# Altium project Uzcar.PrjPCB
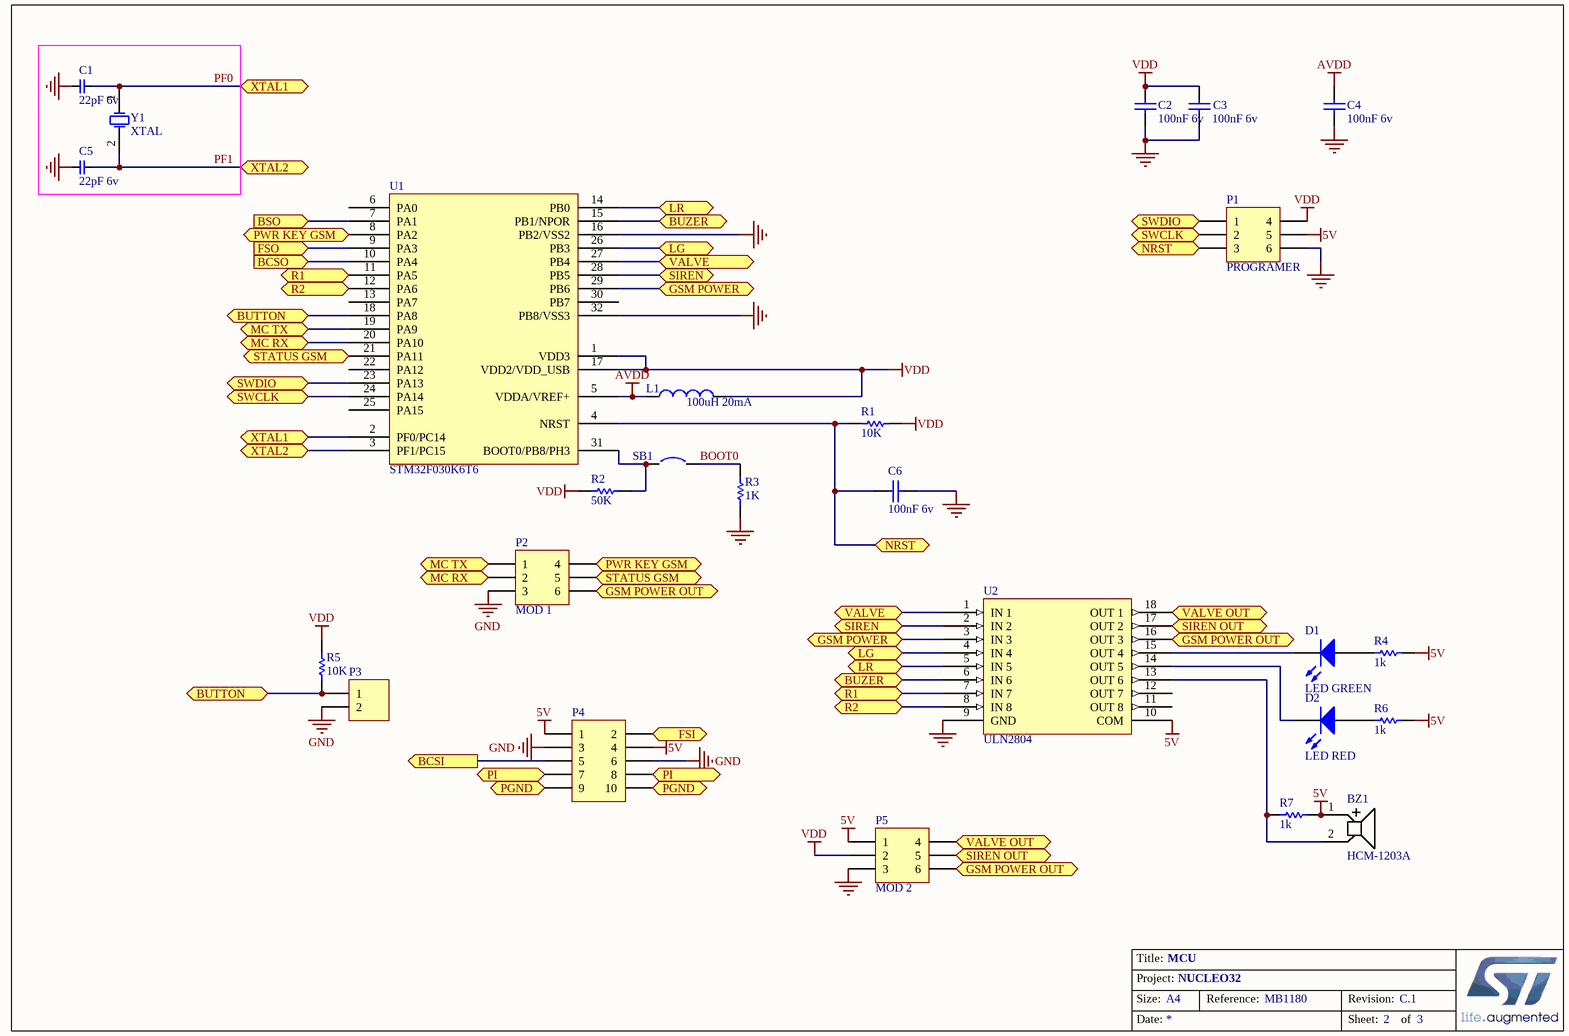
[diagram p0: Copy of MCU_32.SchDoc]
2 sheets, 70 parts. Net scope: global (net labels, ports and power ports of the same name join across sheets).
Board file: Uzcar.PcbDoc
Sheets:
  Copy of MCU_32.SchDoc
  MCU_32_1.SchDoc

## Sheet Copy of MCU_32.SchDoc: MCU
size A4; DocumentNumber: MB1180; Revision: C.1; SheetNumber: 2; SheetTotal: 3; Project: NUCLEO32

### Parts
BZ1  HCM-1203A  [HCM-1203A]
C1  22pF 6v  [CAP0603]
C2  100nF 6v  [0603C]
C3  100nF 6v  [0603C]
C4  100nF 6v  [0603C]
C5  22pF 6v  [CAP0603]
C6  100nF 6v  [0603C]
D1  LED GREEN  [My Green Led]
D2  LED RED  [My_LED3MM]
L1  100uH 20mA  [0603L]
P1  PROGRAMER  [HDR2X3_CEN]
P2  MOD 1  [HDR2X3_CEN]
P3  MHDR1X2  [HDR1X2]  (value not drawn)
P4  Header 5X2  [HDR2X5]  (value not drawn)
P5  MOD 2  [HDR2X3_CEN]
R1  10K  [0603R]
R2  50K  [0603R]
R3  1K  [0603R]
R4  1k  [RES 1206/3216]
R5  10K  [0603R]
R6  1k  [RES 1206/3216]
R7  1k  [RES 1206/3216]
SB1  Circuit Breaker  [SB_0603]  (value not drawn)
U1  STM32F030K6T6  [LQFP32_0R5_7x7]
U2  ULN2804  [SOL-18_N]
Y1  XTAL  [3SMXA]

### Ports
BCSI (out), BCSO (in), BSO (in), BUTTON, BUZER (bidir), FSI (out), FSO (in), GSM POWER (bidir), GSM POWER OUT (out), LG (bidir), LR (bidir), MC RX (bidir), MC TX (bidir), NRST, PGND (bidir), PI (bidir), PWR KEY GSM (bidir), R1 (bidir), R2 (bidir), SIREN (bidir), SIREN OUT (out), STATUS GSM (bidir), SWCLK, SWDIO, VALVE (bidir), VALVE OUT (out), XTAL1 (bidir), XTAL2 (bidir)

### Nets
5V: BZ1.1 P1.5 P4.1 P4.4 P5.1 R4.2 R6.2 R7.1 U2.10(COM)
AVDD: C4.1 L1.1 U1.5(VDDA/VREF+)
GND: C1.2 C2.2 C3.2 C4.2 C5.2 C6.1 P1.6 P2.3 P3.2 P4.3 P4.6 P5.3 R3.2 U1.16(PB2/VSS2) U1.32(PB8/VSS3) U2.9(GND)
VDD: C2.1 C3.1 L1.2 P1.4 P5.2 R1.1 R2.2 R5.1 U1.1(VDD3) U1.17(VDD2/VDD_USB)
BOOT0: R3.1 SB1.2
PF0: C1.1 U1.2(PF0/PC14) Y1.1(OSC1) ; port XTAL1
PF1: C5.1 U1.3(PF1/PC15) Y1.2(OSC2) ; port XTAL2
NetBZ1_2: BZ1.2 R7.2 U2.13(OUT_6)
NetC6_2: C6.2 P1.3 R1.2 U1.4(NRST) ; port NRST
NetC20_2: P4.9 P4.10 ; port PGND
NetD1_A: D1.A R4.1
NetD1_K: D1.K U2.15(OUT_4)
NetD2_A: D2.A R6.1
NetD2_K: D2.K U2.14(OUT_5)
NetP1_1: P1.1 U1.23(PA13) ; port SWDIO
NetP1_2: P1.2 U1.24(PA14) ; port SWCLK
NetP2_1: P2.1 U1.19(PA9) ; port MC TX
NetP2_2: P2.2 U1.20(PA10) ; port MC RX
NetP2_4: P2.4 U1.8(PA2) ; port PWR KEY GSM
NetP2_5: P2.5 U1.21(PA11) ; port STATUS GSM
NetP2_6: P2.6 P5.6 U2.16(OUT_3) ; port GSM POWER OUT
NetP3_1: P3.1 R5.2 U1.18(PA8) ; port BUTTON
NetP4_2: P4.2 ; port FSI
NetP4_5: P4.5 ; port BCSI
NetP4_7: P4.7 P4.8 ; port PI
NetP5_4: P5.4 U2.18(OUT_1) ; port VALVE OUT
NetP5_5: P5.5 U2.17(OUT_2) ; port SIREN OUT
NetR2_1: R2.1 SB1.1 U1.31(BOOT0/PB8/PH3)
NetU1_7: U1.7(PA1) ; port BSO
NetU1_9: U1.9(PA3) ; port FSO
NetU1_10: U1.10(PA4) ; port BCSO
NetU1_11: U1.11(PA5) U2.7(IN_7) ; port R1
NetU1_12: U1.12(PA6) U2.8(IN_8) ; port R2
NetU1_14: U1.14(PB0) U2.5(IN_5) ; port LR
NetU1_15: U1.15(PB1/NPOR) U2.6(IN_6) ; port BUZER
NetU1_26: U1.26(PB3) U2.4(IN_4) ; port LG
NetU1_27: U1.27(PB4) U2.1(IN_1) ; port VALVE
NetU1_28: U1.28(PB5) U2.2(IN_2) ; port SIREN
NetU1_29: U1.29(PB6) U2.3(IN_3) ; port GSM POWER

Not connected (* = marked no-connect by the designer): U1 6(PA0) 13(PA7) 22(PA12) 25(PA15) 30(PB7); U2 11(OUT_8) 12(OUT_7)

### Notes on the sheet
- Title:
- Project:
- Size:
- Date:
- A4
- Reference:
- Sheet:
- Revision:
- of

### Library data of the parts
BZ1 = HCM-1203A: HCM-1203A buzzer
C1 C5 = Capacitor_np: Value: 22pF 5v
C2 = Cap: Capacitor 100nF 5v; Value: 10nF; Published: 8-Jun-2000; Revision: July-2002: Re-released for DXP Platform.; Publisher: Altium Limited
C3 C4 = Cap: Capacitor; Value: 10nF; Published: 8-Jun-2000; Revision: July-2002: Re-released for DXP Platform.; Publisher: Altium Limited
C6 = CAP: Capacitor; Value: 100pF; Published: 8-Jun-2000; Revision: July-2002: Re-released for DXP Platform.; Publisher: Altium Limited
D1 D2 = LED3m: Typical INFRARED GaAs LED; Published: 8-Jun-2000; LatestRevisionDate: 08-Jul-2005; LatestRevisionNote: Mech Layer 1 removed.; Publisher: Altium Limited
L1 = Inductor: Published: 8-Jun-2000; Revision: July-2002: Re-released for DXP Platform.; Publisher: Altium Limited; Value: 100uH
P1 P2 P5 = Header 3X2A: Header, 3-Pin, Dual row; LatestRevisionDate: 17-Jul-2002; LatestRevisionNote: Re-released for DXP Platform.; Publisher: Altium Limited
P3 = MHDR1X2: Header, 2-Pin; LatestRevisionDate: 17-Jul-2002; LatestRevisionNote: Re-released for DXP Platform.; Publisher: Altium Limited
P4 = Header 5X2: Header, 5-Pin, Dual row; LatestRevisionDate: 17-Jul-2002; LatestRevisionNote: Re-released for DXP Platform.; Publisher: Altium Limited
R1 R2 R5 = Res1: Resistor; Value: 1K; Published: 8-Jun-2000; Revision: July-2002: Re-released for DXP Platform.; Publisher: Altium Limited
R3 = res1: Resistor; Published: 8-Jun-2000; Revision: July-2002: Re-released for DXP Platform.; Publisher: Altium Limited; Value: 1K
R4 R6 R7 = Resistor1: Resistor; Value: =Value
SB1 = Circuit Breaker: Solder: NO; Published: 24-Mar-1999; Revision: July-2002: Re-released for DXP Platform.; Publisher: Altium Limited
U1 = MCU_LQFP32: Type: STM32F030K6T6
U2 = ULN2803: HIGH-VOLTAGE,HIGH-CURRENT DARLINTON ARRAYS
Y1 = XTAL: Crystal Oscillator 0.197" L x 0.126" W (5.00mm x 3.20mm); Published: 8-Jun-2000; LatestRevisionDate: 17-Jul-2002; LatestRevisionNote: Re-released for DXP Platform.; PackageReference: R38; Publisher: Altium Limited; PackageDescription: Crystal, Thru-Hole; 2 Leads; Body 3.1 x 8.2 mm (Dia.xH)

## Sheet MCU_32_1.SchDoc
size A4
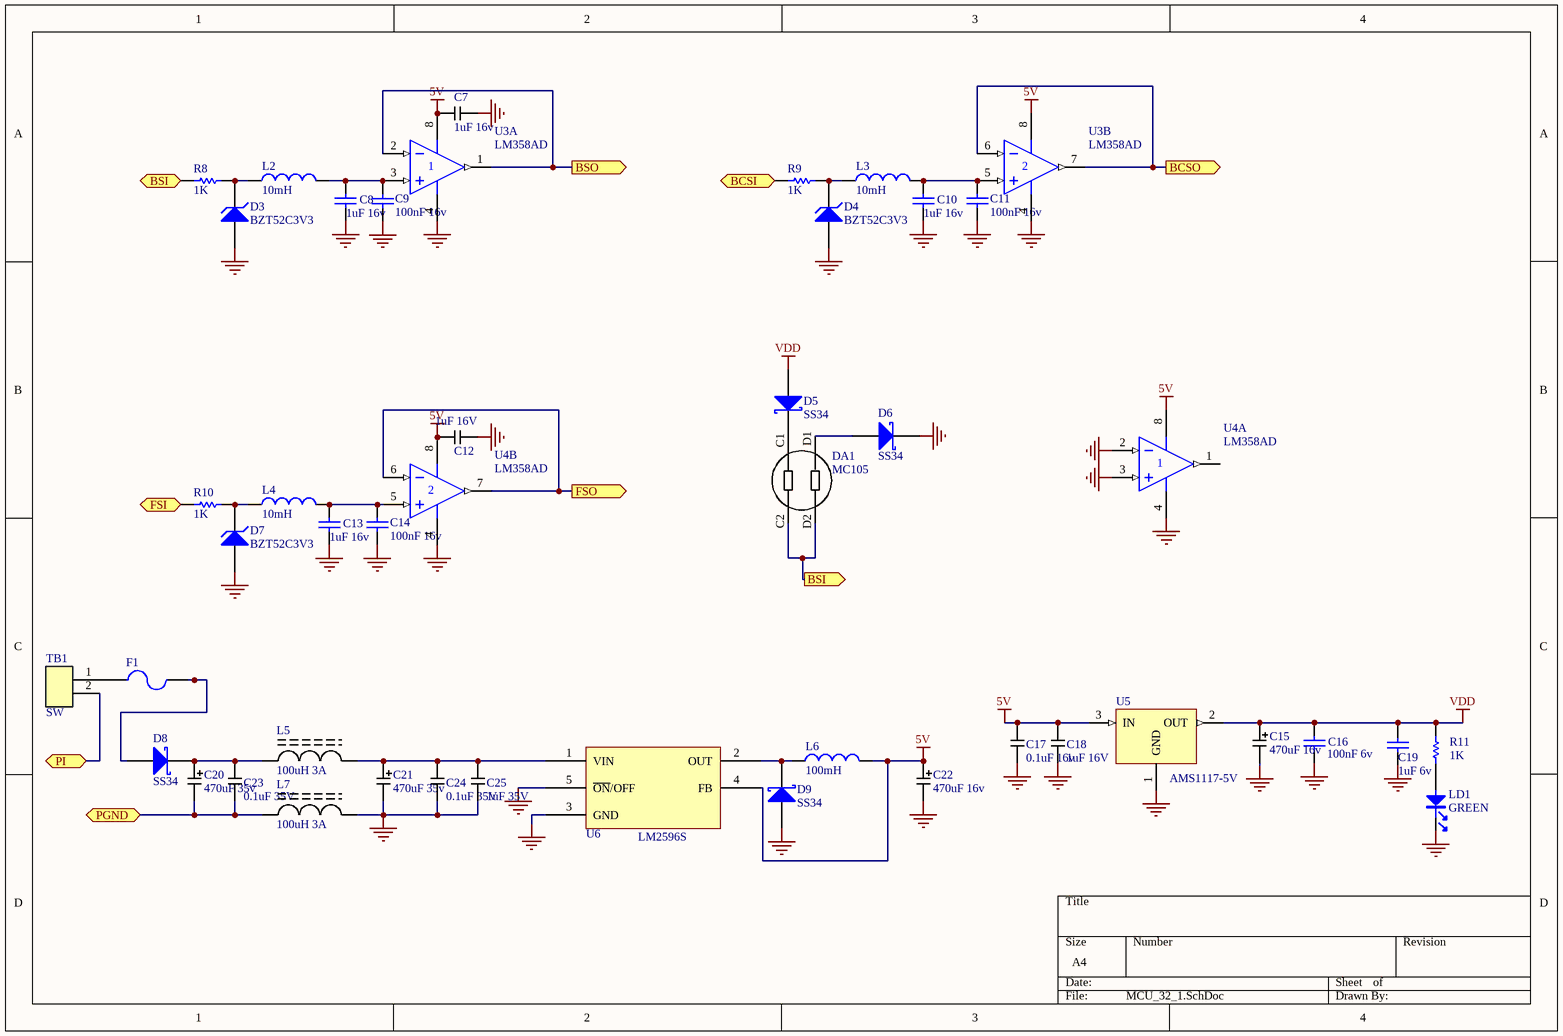
[diagram p1: MCU_32_1.SchDoc]

### Parts
C7  1uF 16v  [C1206]
C8  1uF 16v  [0603C]
C9  100nF 16v  [0603C]
C10  1uF 16v  [0603C]
C11  100nF 16v  [0603C]
C12  1uF 16V  [C1206]
C13  1uF 16v  [0603C]
C14  100nF 16v  [0603C]
C15  470uF 16v  [C_EL_8]
C16  100nF 6v  [0603C]
C17  0.1uF 16v  [C1206]
C18  1uF 16V  [C1206]
C19  1uF 6v  [0603C]
C20  470uF 35v  [C_EL_10]
C21  470uF 35v  [C_EL_10]
C22  470uF 16v  [C_EL_8]
C23  0.1uF 35V  [C1206]
C24  0.1uF 35V  [C1206]
C25  1uF 35V  [C1206]
D3  BZT52C3V3  [SOD-123]
D4  BZT52C3V3  [SOD-123]
D5  SS34  [SMB]
D6  SS34  [SMB]
D7  BZT52C3V3  [SOD-123]
D8  SS34  [SMB]
D9  SS34  [SMB]
DA1  MC105  [MC105]
F1  Fuse 2  [1812]  (value not drawn)
L2  10mH  [6-0805_L]
L3  10mH  [6-0805_L]
L4  10mH  [6-0805_L]
L5  100uH 3A  [NR60]
L6  100mH  [IND12500]
L7  100uH 3A  [NR60]
LD1  GREEN  [0603D_R]
R8  1K  [0603R]
R9  1K  [0603R]
R10  1K  [0603R]
R11  1K  [0603R]
TB1  SW  [terminal block2p]
U3  LM358AD  [SO-8]  (parts A,B of 2)
U4  LM358AD  [SO-8]  (parts A,B of 2)
U5  AMS1117-5V  [AMS1117]
U6  LM2596S  [TO-263]

### Ports
BCSI (in), BCSO (out), BSI (in), BSI (out), BSO (out), FSI (in), FSO (out), PGND (bidir), PI (bidir)

### Nets
5V: C7.1 C12.1 C17.1 C18.1 C22.1 L6.2 U3.8(V+) U4.8(V+) U5.3(IN) U6.4(FB)
GND: C7.2 C8.2 C9.2 C10.2 C11.2 C12.2 C13.2 C14.2 C15.2 C16.1 C17.2 C18.2 C19.2 C21.2 C22.2 C24.2 C25.2 D3.1(A) D4.1(A) D6.2(K) D7.1(A) D9.1(A) L7.2 LD1.2 U3.4(V-) U4.2(IN-) U4.3(IN+) U4.4(V-) U5.1(GND) U6.3(GND) U6.5(~{ON}/OFF)
VDD: C15.1 C16.2 C19.1 D5.1(A) R11.2 U5.2(OUT)
NetC8_1: C8.1 C9.1 L2.2 U3.3(IN+)
NetC10_1: C10.1 C11.1 L3.2 U3.5(IN+)
NetC13_1: C13.1 C14.1 L4.2 U4.5(IN+)
NetC20_1: C20.1 C23.1 D8.2(K) L5.1
NetC20_2: C20.2 C23.2 L7.1 ; port PGND
NetC21_1: C21.1 C24.1 C25.1 L5.2 U6.1(VIN)
NetD3_2: D3.2(K) L2.1 R8.1
NetD4_2: D4.2(K) L3.1 R9.1
NetD5_2: D5.2(K) DA1.C1
NetD6_1: D6.1(A) DA1.D1
NetD7_2: D7.2(K) L4.1 R10.1
NetD8_1: D8.1(A) F1.2
NetD9_2: D9.2(K) L6.1 U6.2(OUT)
NetDA1_C2: DA1.C2 DA1.D2 R8.2 ; port BSI
NetF1_1: F1.1 TB1.1
NetLD1_1: LD1.1 R11.1
NetP4_2: R10.2 ; port FSI
NetP4_5: R9.2 ; port BCSI
NetP4_7: TB1.2 ; port PI
NetU1_7: U3.1(OUT) U3.2(IN-) ; port BSO
NetU1_9: U4.6(IN-) U4.7(OUT) ; port FSO
NetU1_10: U3.6(IN-) U3.7(OUT) ; port BCSO

Not connected (* = marked no-connect by the designer): U4 1(OUT)

### Library data of the parts
C7 = C: Capacitor 1uF 16v
C8 C10 C13 C19 = CAP SMD 0603  X5R 1µF 25V 10%: 0603  X5R 1µF; Rated voltage: 25V; Tolerance: 10%; Manufacturer: *; Manufacturer P/N: *; Order code Farnell: 1288202RL; Value: 1µF; Power: *; Technology: X5R; Temperature  Factor: *; Temperature Max: +125°C; Temperature Min: -55°C; STS Code: *
C9 C11 C14 = CAP: Capacitor; Value: 100pF; Published: 8-Jun-2000; Revision: July-2002: Re-released for DXP Platform.; Publisher: Altium Limited
C12 C18 = C: Capacitor 1uF 16V
C15 C20-C22 = CP: Capacitor polarized
C16 = Capacitor_ST: Capacitor 0402 / 0603 / 0805; Revision: July-2002: Re-released for DXP Platform.; Value: 100nF
C17 = C: Capacitor 0.1uF 12V
C23 = C: Capacitor 0.1uF 35V
C24 = C: Capacitor 0.1uF 25V
C25 = C: Capacitor 1uF 25V
D3 D4 D7 = BZT52C3V6: Surface Mount Zener Diode; Published: 8-Jun-2000; LatestRevisionDate: 17-Jul-2002; LatestRevisionNote: Re-released for DXP Platform.; DatasheetDocument: REV. L-2; PackageReference: SOD-123; Publisher: Altium Limited; ComponentLink1Description: Manufacturer Link; ComponentLink1URL: http://www.vishay.com/
D5 D6 D8 D9 = D Schottky: Schottky Diode 40V 3A; Published: 8-Jun-2000; LatestRevisionDate: 17-Jul-2002; LatestRevisionNote: Re-released for DXP Platform.; PackageReference: SMB; Publisher: Altium Limited; PackageDescription: DO-214-AA/SMB; 2 C-Bend Leads; Body 5.3 x 3.6 mm, inc. leads (LxW); Code_JEDEC: DO-214-AA
F1 = Fuse 2: Fuse; Published: 8-Jun-2000; LatestRevisionDate: 17-Jul-2002; LatestRevisionNote: Re-released for DXP Platform.; PackageReference: PIN-W2/E2.8; Publisher: Altium Limited; PackageDescription: Thru-Hole; 2 Leads
L2-L4 L6 = Inductor: Code_IEC: 1005; Published: 8-Jun-2000; LatestRevisionDate: 29-May-2009; LatestRevisionNote: IPC-7351 Footprint Added.; PackageReference: 0402-A; Publisher: Altium Limited; PackageDescription: Chip Inductor; Code_JEITA: 0402
  L2-L4: Value: 10mH
  L6: Value: 100mH
L5 = L: Inductor 100uH 3A
L7 = L: Inductor 100uH 23
LD1 = PHOTO
R8-R10 = Res1: Resistor; Published: 8-Jun-2000; Revision: July-2002: Re-released for DXP Platform.; Publisher: Altium Limited; Value: 1K
R11 = Resistor_ST: Resistor 0402 / 0603 / 0805; Value: 10K
TB1 = Terminal block 2p: Terminal block 2p 2.54mm; Value: =Value
U3 U4 = LM358AD: Dual Operational Amplifier; Published: 15-Apr-2002; LatestRevisionDate: 13-Apr-2006; LatestRevisionNote: IPC-7351 Footprint Added.; DatasheetVersion: Aug-1988; PackageVersion: Jan-1998; PackageReference: D008; Publisher: Altium Limited; PackageDescription: 8-Pin Small Outline Integrated Circuit 1.27 mm Pitch; Code_IPC: SOIC127P600-8; ComponentLink1Description: Manufacturer Link; ComponentLink1URL: http://www.ti.com/; ComponentLink2Description: Datasheet; ComponentLink2URL: http://www-s.ti.com/sc/ds/lm358.pdf
U5 = AMS1117
U6 = TI LM2596

## Nets that join several sheets
5V: Copy of MCU_32 (9 pins), MCU_32_1 (10 pins)
GND: Copy of MCU_32 (16 pins), MCU_32_1 (31 pins)
VDD: Copy of MCU_32 (10 pins), MCU_32_1 (6 pins)
NetC20_2: Copy of MCU_32 (P4.9 P4.10), MCU_32_1 (C20.2 C23.2 L7.1)
NetP4_2: Copy of MCU_32 (P4.2), MCU_32_1 (R10.2)
NetP4_5: Copy of MCU_32 (P4.5), MCU_32_1 (R9.2)
NetP4_7: Copy of MCU_32 (P4.7 P4.8), MCU_32_1 (TB1.2)
NetU1_7: Copy of MCU_32 (U1.7), MCU_32_1 (U3.1 U3.2)
NetU1_9: Copy of MCU_32 (U1.9), MCU_32_1 (U4.6 U4.7)
NetU1_10: Copy of MCU_32 (U1.10), MCU_32_1 (U3.6 U3.7)